# Altium schematic sheet Level_shifter.SchDoc
size A4; SheetNumber: 7; SheetTotal: 8
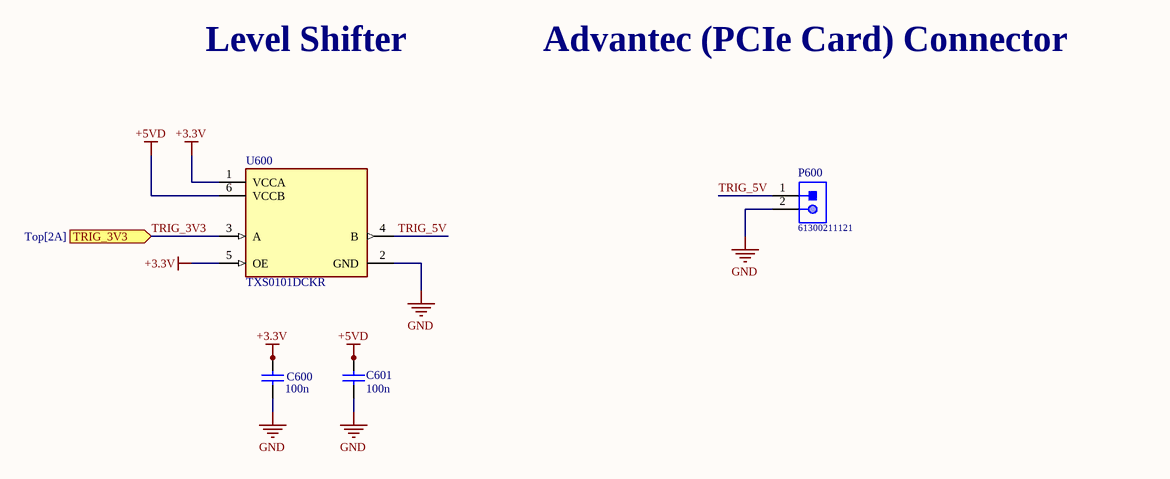
[diagram p0: Level_shifter.SchDoc]

## Parts
C600  100n  [SAMS-C0603-2_M]
C601  100n  [SAMS-C0603-2_M]
P600  61300211121  [61300211121]
U600  TXS0101DCKR  [FP-DCK0006A-MFG]

## Ports
TRIG_3V3 (in, see Top[2A])

## Nets
+3.3V: C600.2 U600.1(VCCA) U600.5(OE)
+5VD: C601.2 U600.6(VCCB)
GND: C600.1 C601.1 P600.2 U600.2(GND)
TRIG_3V3: U600.3(A) ; port TRIG_3V3
TRIG_5V: P600.1 U600.4(B)

## Notes on the sheet
- Level Shifter
- Advantec (PCIe Card) Connector

## Library data of the parts
C600 C601 = CMP-2000-05332-1: Multi-layer Ceramic Capacitor, -55 to 125 degC, 2-Pin SMD (0603), RoHS, Tape and Reel; Manufacturer: Samsung Electro-Mechanics; Capacitance: 0.1µF; Rated Voltage: 50V; Dielectric: X7R; Tolerance (%): ±10%; Case Size/Dimension: 0603; Datasheet URL: https://datasheet.ciiva.com/29198/456651-da-01-en-vs-kondensator-0605-29198839.pdf; Manufacturer URL: http://www.samsungsem.com/global/index.jsp; Datasheet Version: Nov-10
P600 = CMP-1712-00002-4: THT Vertical Pin Header WR-PHD, Pitch 2.54 mm, Single Row, 2 pins; Manufacturer: Wurth Elektronik; Rated Current: 3A; Gender: Male; Withstanding Voltage: 500VAC; Working Voltage: 250VAC; Pitch: 2.54mm; Contact Resistance: 20mOhm; Pin Number: 2; Mounting Technology: THT; Orientation: Vertical; Operating Temperature: -40to105degC; Packaging: Bag; Publisher: WurthElektronik; Datasheet URL: https://katalog.we-online.de/em/datasheet/6130xx11121.pdf; Manufacturer URL: http://www.we-online.de; Row Number: Single; Package Reference: 61300211121; Part Number: 61300211121
U600 = CMP-04899-000067-1: IC TRNSLTR BIDIRECTIONAL SC70-6; Propagation Delay: 260ns; Number of Channels: 1; Min Supply Voltage: 1.65V; Logic Function: Translator; Output Type: Voltage; Low Level Output Current: 1mA; Data Rate: 24Mbps; Quiescent Current: 14.4uA; Max Supply Voltage: 5.5V; High Level Output Current: -20uA; Series: -; RoHS Compliant: Yes; Radiation Hardening: No; Number of Bits: 1; Min Operating Temperature: -40°C; Max Operating Temperature: 85°C; REACH SVHC: No SVHC; Lead Free: Lead Free; Number of Pins: 6; Package Quantity: 1; Turn-On Delay Time: 260ns; Mount: Surface Mount; Packaging: Tape and Reel; Number of Inputs: 1; Case/Package: SC